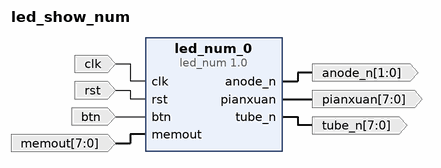
[diagram p0: block diagram of the top level]
# Vivado block design led_show_num, xc7a35tcsg324-1, Vivado 2019.2
create_bd_design led_show_num

create_bd_port -dir I -type clk clk
create_bd_port -dir I -type rst rst
create_bd_port -dir I btn
create_bd_port -dir I -from 7 -to 0 memout
create_bd_port -dir O -from 7 -to 0 pianxuan
create_bd_port -dir O -from 1 -to 0 anode_n
create_bd_port -dir O -from 7 -to 0 tube_n

create_bd_cell -type ip -vlnv xilinx.com:user:led_num:1.0 led_num_0

# ---- connections ----

connect_bd_net -net clk_0_1 [get_bd_ports clk] [get_bd_pins led_num_0/clk]
connect_bd_net -net rst_0_1 [get_bd_ports rst] [get_bd_pins led_num_0/rst]
connect_bd_net -net btn_0_1 [get_bd_ports btn] [get_bd_pins led_num_0/btn]
connect_bd_net -net memout_0_1 [get_bd_ports memout] [get_bd_pins led_num_0/memout]
connect_bd_net [get_bd_pins led_num_0/pianxuan] [get_bd_ports pianxuan]
connect_bd_net [get_bd_pins led_num_0/anode_n] [get_bd_ports anode_n]
connect_bd_net [get_bd_pins led_num_0/tube_n] [get_bd_ports tube_n]

validate_bd_design
save_bd_design
